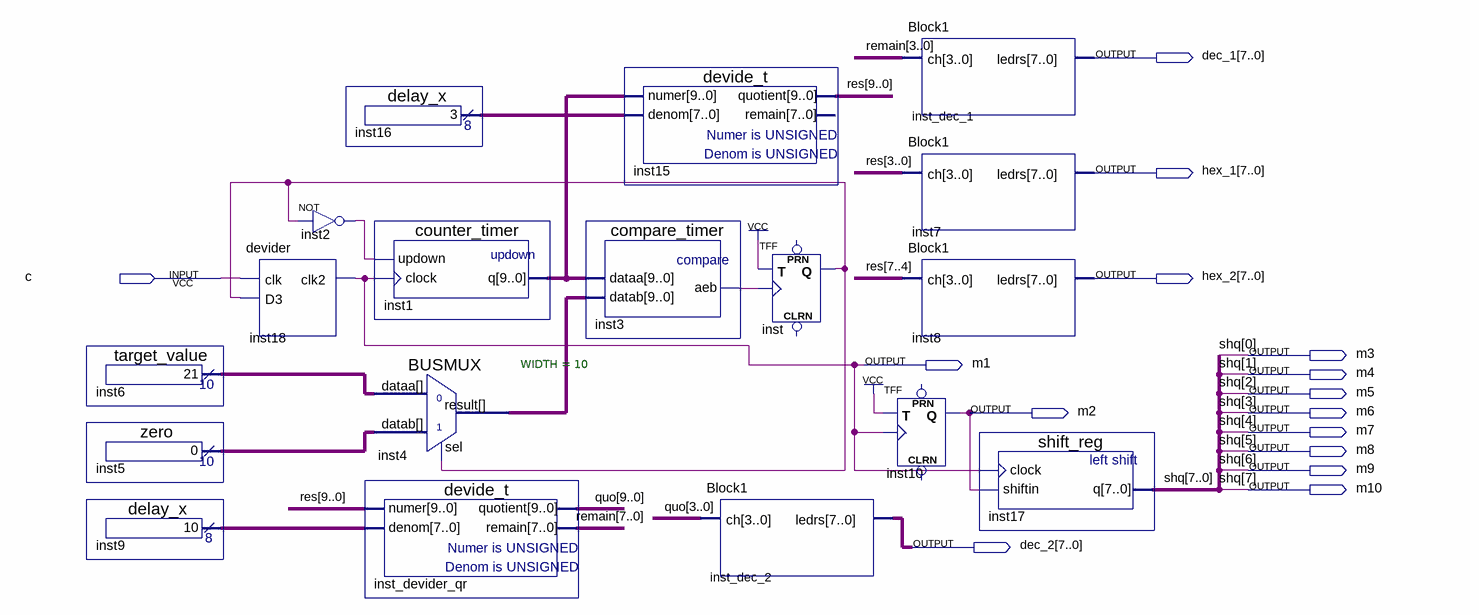
[diagram p0: schematic sheet]
// Quartus schematic prod.bdf as structural Verilog: 18 symbols, 15 pins
module prod (
  input  c,
  output [7:0] dec_1,
  output [7:0] hex_1,
  output [7:0] hex_2,
  output m3,
  output m1,
  output m4,
  output m5,
  output m2,
  output m6,
  output m7,
  output m8,
  output m9,
  output m10,
  output [7:0] dec_2
);

  wire inst2_out, inst3_aeb, inst_q;
  wire [7:0] inst9_result, inst16_result, remain;
  wire [9:0] inst1_q, inst4_result, inst5_result, inst6_result, quo, res;

  target_value inst6 (.result(inst6_result));
  zero inst5 (.result(inst5_result));
  delay_x inst9 (.result(inst9_result));
  not inst2 (inst2_out, inst_q);
  devider inst18 (.clk(c), .D3(inst_q), .clk2(m1));
  delay_x inst16 (.result(inst16_result));
  counter_timer inst1 (.updown(inst2_out), .clock(m1), .q(inst1_q));
  BUSMUX #(.WIDTH(10)) inst4 (.datab(inst5_result), .sel(inst_q), .dataa(inst6_result), .result(inst4_result));
  devide_t inst_devider_qr (.numer(res), .denom(inst9_result), .quotient(quo), .remain(remain));
  compare_timer inst3 (.dataa(inst1_q), .datab(inst4_result), .aeb(inst3_aeb));
  devide_t inst15 (.numer(inst1_q), .denom(inst16_result), .quotient(res));  // open: remain
  TFF inst (.T(1'b1), .CLK(inst3_aeb), .Q(inst_q));  // open: PRN, CLRN
  Block1 inst_dec_2 (.ch(quo[3:0]), .ledrs(dec_2));
  Block1 inst_dec_1 (.ch(remain[3:0]), .ledrs(dec_1));
  Block1 inst7 (.ch(res[3:0]), .ledrs(hex_1));
  Block1 inst8 (.ch(res[7:4]), .ledrs(hex_2));
  TFF inst10 (.T(1'b1), .CLK(m1), .Q(m2));  // open: PRN, CLRN
  shift_reg inst17 (.clock(m1), .shiftin(m2), .q({m10, m9, m8, m7, m6, m5, m4, m3}));

  // Other names for the same wires on the sheet: shq[7:0] = {m10, m9, m8, m7, m6, m5, m4, m3}
endmodule
